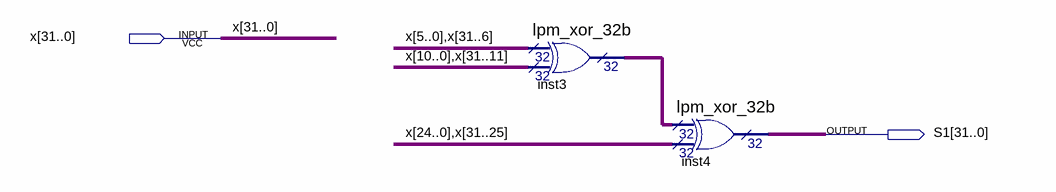
[diagram p0: schematic sheet]
// Quartus schematic S1.bdf as structural Verilog: 2 symbols, 2 pins
module S1 (
  input  [31:0] x,
  output [31:0] S1
);

  wire [31:0] inst3_result;

  lpm_xor_32b inst3 (.data0x({x[5:0], x[31:6]}), .data1x({x[10:0], x[31:11]}), .result(inst3_result));
  lpm_xor_32b inst4 (.data0x(inst3_result), .data1x({x[24:0], x[31:25]}), .result(S1));
endmodule
